# Altium schematic sheet driveIII.SchDoc
size A3
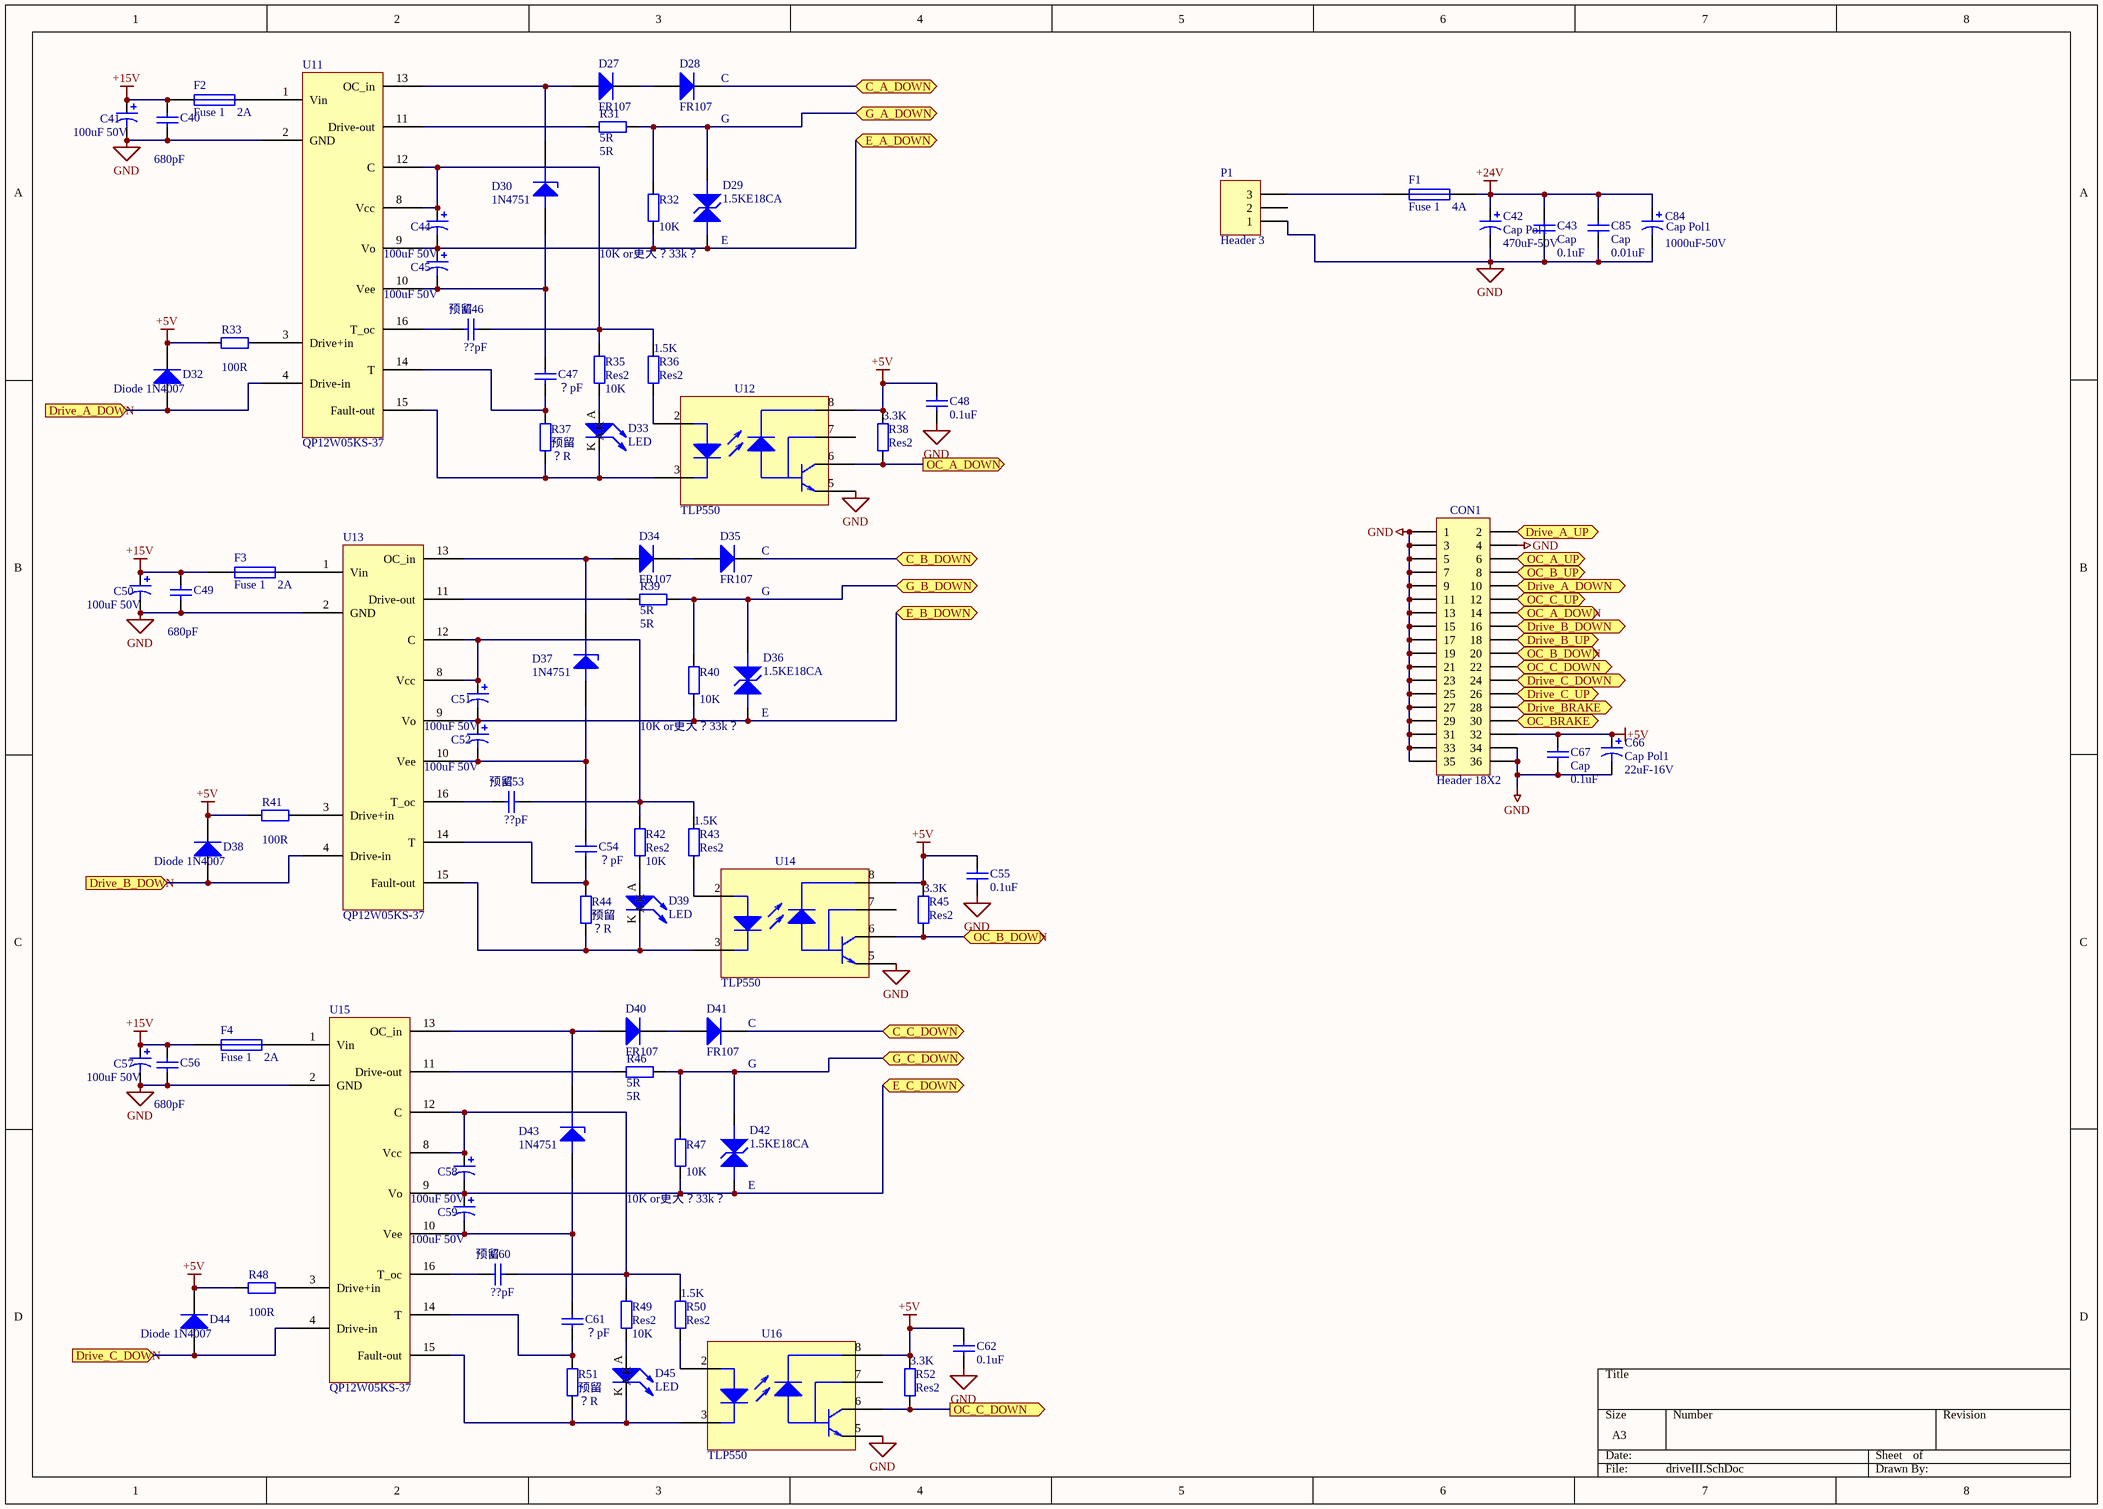
[diagram p0: driveIII.SchDoc]

## Parts
C40  value 680pF  [1206]  (hidden comment: Cap)
C41  value 100uF 50V  [电解电容1000uF]  (hidden comment: Cap Pol1)
C42  Cap Pol1  value 470uF-50V  [电解电容470uf]
C43  Cap  value 0.1uF  [1206]
C44  value 100uF 50V  [电解电容1000uF]  (hidden comment: Cap Pol1)
C45  value 100uF 50V  [电解电容1000uF]  (hidden comment: Cap Pol1)
C46  预留  value ??pF  [1206]
C47  value ？pF  [1206]  (hidden comment: 预留)
C48  value 0.1uF  [1206]  (hidden comment: Cap)
C49  value 680pF  [1206]  (hidden comment: Cap)
C50  value 100uF 50V  [电解电容1000uF]  (hidden comment: Cap Pol1)
C51  value 100uF 50V  [电解电容1000uF]  (hidden comment: Cap Pol1)
C52  value 100uF 50V  [电解电容1000uF]  (hidden comment: Cap Pol1)
C53  预留  value ??pF  [1206]
C54  value ？pF  [1206]  (hidden comment: 预留)
C55  value 0.1uF  [1206]  (hidden comment: Cap)
C56  value 680pF  [1206]  (hidden comment: Cap)
C57  value 100uF 50V  [电解电容1000uF]  (hidden comment: Cap Pol1)
C58  value 100uF 50V  [电解电容1000uF]  (hidden comment: Cap Pol1)
C59  value 100uF 50V  [电解电容1000uF]  (hidden comment: Cap Pol1)
C60  预留  value ??pF  [1206]
C61  value ？pF  [1206]  (hidden comment: 预留)
C62  value 0.1uF  [1206]  (hidden comment: Cap)
C66  Cap Pol1  value 22uF-16V  [7343]
C67  Cap  value 0.1uF  [1206]
C84  Cap Pol1  value 1000uF-50V  [电解电容1000uF]
C85  Cap  value 0.01uF  [1206]
CON1  Header 18X2  [HDR2X18]
D27  FR107  [DIODE-0.4]
D28  FR107  [DIODE-0.4]
D29  1.5KE18CA  [AXIAL0.4]
D30  1N4751  [DIODE0.4]
D32  Diode 1N4007  [DIODE-0.4]
D33  LED  [0805D]
D34  FR107  [DIODE-0.4]
D35  FR107  [DIODE-0.4]
D36  1.5KE18CA  [AXIAL0.4]
D37  1N4751  [DIODE0.4]
D38  Diode 1N4007  [DIODE-0.4]
D39  LED  [0805D]
D40  FR107  [DIODE-0.4]
D41  FR107  [DIODE-0.4]
D42  1.5KE18CA  [AXIAL0.4]
D43  1N4751  [DIODE0.4]
D44  Diode 1N4007  [DIODE-0.4]
D45  LED  [0805D]
F1  Fuse 1　4A  [FUSE]
F2  Fuse 1　2A  [CAPR5-4X5]
F3  Fuse 1　2A  [CAPR5-4X5]
F4  Fuse 1　2A  [CAPR5-4X5]
P1  Header 3  [PHENOX-3]
R31  5R  [AXIAL0.6]
R32  10K or更大？33k？  value 10K  [AXIAL0.4]
R33  value 100R  [AXIAL-0.6]  (hidden comment: Res2)
R35  Res2  value 10K  [1206]
R36  Res2  value 1.5K  [1206]
R37  预留  value ？R  [1206]
R38  Res2  value 3.3K  [1206]
R39  5R  [AXIAL0.6]
R40  10K or更大？33k？  value 10K  [AXIAL0.4]
R41  value 100R  [AXIAL-0.6]  (hidden comment: Res2)
R42  Res2  value 10K  [1206]
R43  Res2  value 1.5K  [1206]
R44  预留  value ？R  [1206]
R45  Res2  value 3.3K  [1206]
R46  5R  [AXIAL0.6]
R47  10K or更大？33k？  value 10K  [AXIAL0.4]
R48  value 100R  [AXIAL-0.6]  (hidden comment: Res2)
R49  Res2  value 10K  [1206]
R50  Res2  value 1.5K  [1206]
R51  预留  value ？R  [1206]
R52  Res2  value 3.3K  [1206]
U11  QP12W05KS-37  [QP12W05KS37]
U12  TLP550  [DIP8]
U13  QP12W05KS-37  [QP12W05KS37]
U14  TLP550  [DIP8]
U15  QP12W05KS-37  [QP12W05KS37]
U16  TLP550  [DIP8]

## Ports
C_A_DOWN, C_B_DOWN, C_C_DOWN, Drive_A_DOWN (in), Drive_A_DOWN (out), Drive_A_UP (out), Drive_B_DOWN (in), Drive_B_DOWN (out), Drive_B_UP (out), Drive_BRAKE (out), Drive_C_DOWN (in), Drive_C_DOWN (out), Drive_C_UP (out), E_A_DOWN, E_B_DOWN, E_C_DOWN, G_A_DOWN, G_B_DOWN, G_C_DOWN, OC_A_DOWN (in), OC_A_DOWN (out), OC_A_UP (in), OC_B_DOWN, OC_B_UP (in), OC_BRAKE (in), OC_C_DOWN (in), OC_C_DOWN (out), OC_C_UP (in)

## Nets
+5V: C48.1 C55.1 C62.1 C66.1 C67.2 CON1.32 D32.2(K) D38.2(K) D44.2(K) R33.2 R38.2 R41.2 R45.2 R48.2 R52.2 U12.8 U14.8 U16.8
+15V: C40.2 C41.1 C49.2 C50.1 C56.2 C57.1 F2.1 F3.1 F4.1
+24V: C42.1 C43.2 C84.1 C85.2 F1.2
GND: C40.1 C41.2 C42.2 C43.1 C48.2 C49.1 C50.2 C55.2 C56.1 C57.2 C62.2 C66.2 C67.1 C84.2 C85.1 CON1.1 CON1.3 CON1.4 CON1.5 CON1.7 CON1.9 CON1.11 CON1.13 CON1.15 CON1.17 CON1.19 CON1.21 CON1.23 CON1.25 CON1.27 CON1.29 CON1.31 CON1.33 CON1.34 CON1.35 CON1.36 P1.1 U11.2(GND) U12.5 U13.2(GND) U14.5 U15.2(GND) U16.5
C_A_DOWN: D28.2(K) ; port C_A_DOWN
C_B_DOWN: D35.2(K) ; port C_B_DOWN
C_C_DOWN: D41.2(K) ; port C_C_DOWN
Drive_A_DOWN: CON1.10 D32.1(A) U11.4(Drive-in) ; port Drive_A_DOWN
Drive_A_UP: CON1.2 ; port Drive_A_UP
Drive_B_DOWN: CON1.16 D38.1(A) U13.4(Drive-in) ; port Drive_B_DOWN
Drive_B_UP: CON1.18 ; port Drive_B_UP
Drive_BRAKE: CON1.28 ; port Drive_BRAKE
Drive_C_DOWN: CON1.24 D44.1(A) U15.4(Drive-in) ; port Drive_C_DOWN
Drive_C_UP: CON1.26 ; port Drive_C_UP
E_A_DOWN: C44.2 C45.1 D29.1 R32.1 U11.9(Vo) ; port E_A_DOWN
E_B_DOWN: C51.2 C52.1 D36.1 R40.1 U13.9(Vo) ; port E_B_DOWN
E_C_DOWN: C58.2 C59.1 D42.1 R47.1 U15.9(Vo) ; port E_C_DOWN
G_A_DOWN: D29.2 R31.2 R32.2 ; port G_A_DOWN
G_B_DOWN: D36.2 R39.2 R40.2 ; port G_B_DOWN
G_C_DOWN: D42.2 R46.2 R47.2 ; port G_C_DOWN
OC_A_DOWN: CON1.14 R38.1 U12.6 ; port OC_A_DOWN
OC_A_UP: CON1.6 ; port OC_A_UP
OC_B_DOWN: CON1.20 R45.1 U14.6 ; port OC_B_DOWN
OC_B_UP: CON1.8 ; port OC_B_UP
OC_BRAKE: CON1.30 ; port OC_BRAKE
OC_C_DOWN: CON1.22 R52.1 U16.6 ; port OC_C_DOWN
OC_C_UP: CON1.12 ; port OC_C_UP
NetC44_1: C44.1 C46.1 R35.2 R36.2 U11.8(Vcc) U11.12(C)
NetC45_2: C45.2 C47.1 D30.A U11.10(Vee)
NetC46_2: C46.2 U11.16(T_oc)
NetC47_2: C47.2 R37.2 U11.14(T)
NetC51_1: C51.1 C53.1 R42.2 R43.2 U13.8(Vcc) U13.12(C)
NetC52_2: C52.2 C54.1 D37.A U13.10(Vee)
NetC53_2: C53.2 U13.16(T_oc)
NetC54_2: C54.2 R44.2 U13.14(T)
NetC58_1: C58.1 C60.1 R49.2 R50.2 U15.8(Vcc) U15.12(C)
NetC59_2: C59.2 C61.1 D43.A U15.10(Vee)
NetC60_2: C60.2 U15.16(T_oc)
NetC61_2: C61.2 R51.2 U15.14(T)
NetD27_1: D27.1(A) D30.K U11.13(OC_in)
NetD27_2: D27.2(K) D28.1(A)
NetD33_A: D33.A R35.1
NetD33_K: D33.K R37.1 U11.15(Fault-out) U12.3
NetD34_1: D34.1(A) D37.K U13.13(OC_in)
NetD34_2: D34.2(K) D35.1(A)
NetD39_A: D39.A R42.1
NetD39_K: D39.K R44.1 U13.15(Fault-out) U14.3
NetD40_1: D40.1(A) D43.K U15.13(OC_in)
NetD40_2: D40.2(K) D41.1(A)
NetD45_A: D45.A R49.1
NetD45_K: D45.K R51.1 U15.15(Fault-out) U16.3
NetF1_1: F1.1 P1.3
NetF2_2: F2.2 U11.1(Vin)
NetF3_2: F3.2 U13.1(Vin)
NetF4_2: F4.2 U15.1(Vin)
NetR31_1: R31.1 U11.11(Drive-out)
NetR33_1: R33.1 U11.3(Drive+in)
NetR36_1: R36.1 U12.2
NetR39_1: R39.1 U13.11(Drive-out)
NetR41_1: R41.1 U13.3(Drive+in)
NetR43_1: R43.1 U14.2
NetR46_1: R46.1 U15.11(Drive-out)
NetR48_1: R48.1 U15.3(Drive+in)
NetR50_1: R50.1 U16.2

Not connected (* = marked no-connect by the designer): P1 2; U12 7; U14 7; U16 7

## Notes on the sheet
- (near D28) C
- G
- (near D29) E
- (near D35) C
- (near D36) E
- (near D41) C
- (near D42) E

## Library data of the parts
C40 C43 C47-C49 C54-C56 C61 C62 C67 C85 = Cap: Capacitor; Published: 8-Jun-2000; LatestRevisionDate: 17-Jul-2002; LatestRevisionNote: Re-released for DXP Platform.; PackageReference: RAD-0.3; Publisher: Altium Limited
C41 C42 C44 C45 C50-C52 C57-C59 C66 C84 = Cap Pol1: Polarized Capacitor (Radial); Published: 8-Jun-2000; LatestRevisionDate: 17-Jul-2002; LatestRevisionNote: Re-released for DXP Platform.; PackageReference: RB7.6-15; Publisher: Altium Limited
C46 C53 C60 = Cap: Published: 8-Jun-2000; LatestRevisionDate: 17-Jul-2002; LatestRevisionNote: Re-released for DXP Platform.; PackageReference: RAD-0.3; Publisher: Altium Limited
CON1 = Header 18X2: Header, 18-Pin, Dual row; LatestRevisionDate: 17-Jul-2002; LatestRevisionNote: Re-released for DXP Platform.; Publisher: Altium Limited
D27 D28 D32 D34 D35 D38 D40 D41 D44 = Diode 1N4148: High Conductance Fast Diode; Published: 8-Jun-2000; LatestRevisionDate: 17-Jul-2002; LatestRevisionNote: Re-released for DXP Platform.; DatasheetVersion: 1997; PackageReference: DO-35; Publisher: Altium Limited; Code_JEDEC: DO-204-AH; ComponentLink1Description: Manufacturer Link; ComponentLink1URL: http://www.fairchildsemi.com/; ComponentLink2Description: Datasheet; ComponentLink2URL: http://www.fairchildsemi.com/ds/1N%2F1N4148.pdf
D29 D36 D42 = D-SMBJ5.0CA: TVS 18V
D30 D37 D43 = ZENER1: Zener Diode 30V
D33 D39 D45 = DIODE1
F1-F4 = Fuse 1: Fuse; Published: 8-Jun-2000; LatestRevisionDate: 17-Jul-2002; LatestRevisionNote: Re-released for DXP Platform.; PackageReference: PIN-W2/E2.8; Publisher: Altium Limited
P1 = Header 3: Header, 3-Pin; LatestRevisionDate: 17-Jul-2002; LatestRevisionNote: Re-released for DXP Platform.; Publisher: Altium Limited
R31-R33 R35-R52 = Res2: Resistor; Published: 8-Jun-2000; LatestRevisionDate: 17-Jul-2002; LatestRevisionNote: Re-released for DXP Platform.; PackageReference: AXIAL-0.4; Publisher: Altium Limited
  R31 R39 R46: Value: 5R
U12 U14 U16 = HCPL4053